# Altium project ESPSpectrumAnalyzer.PrjPcb
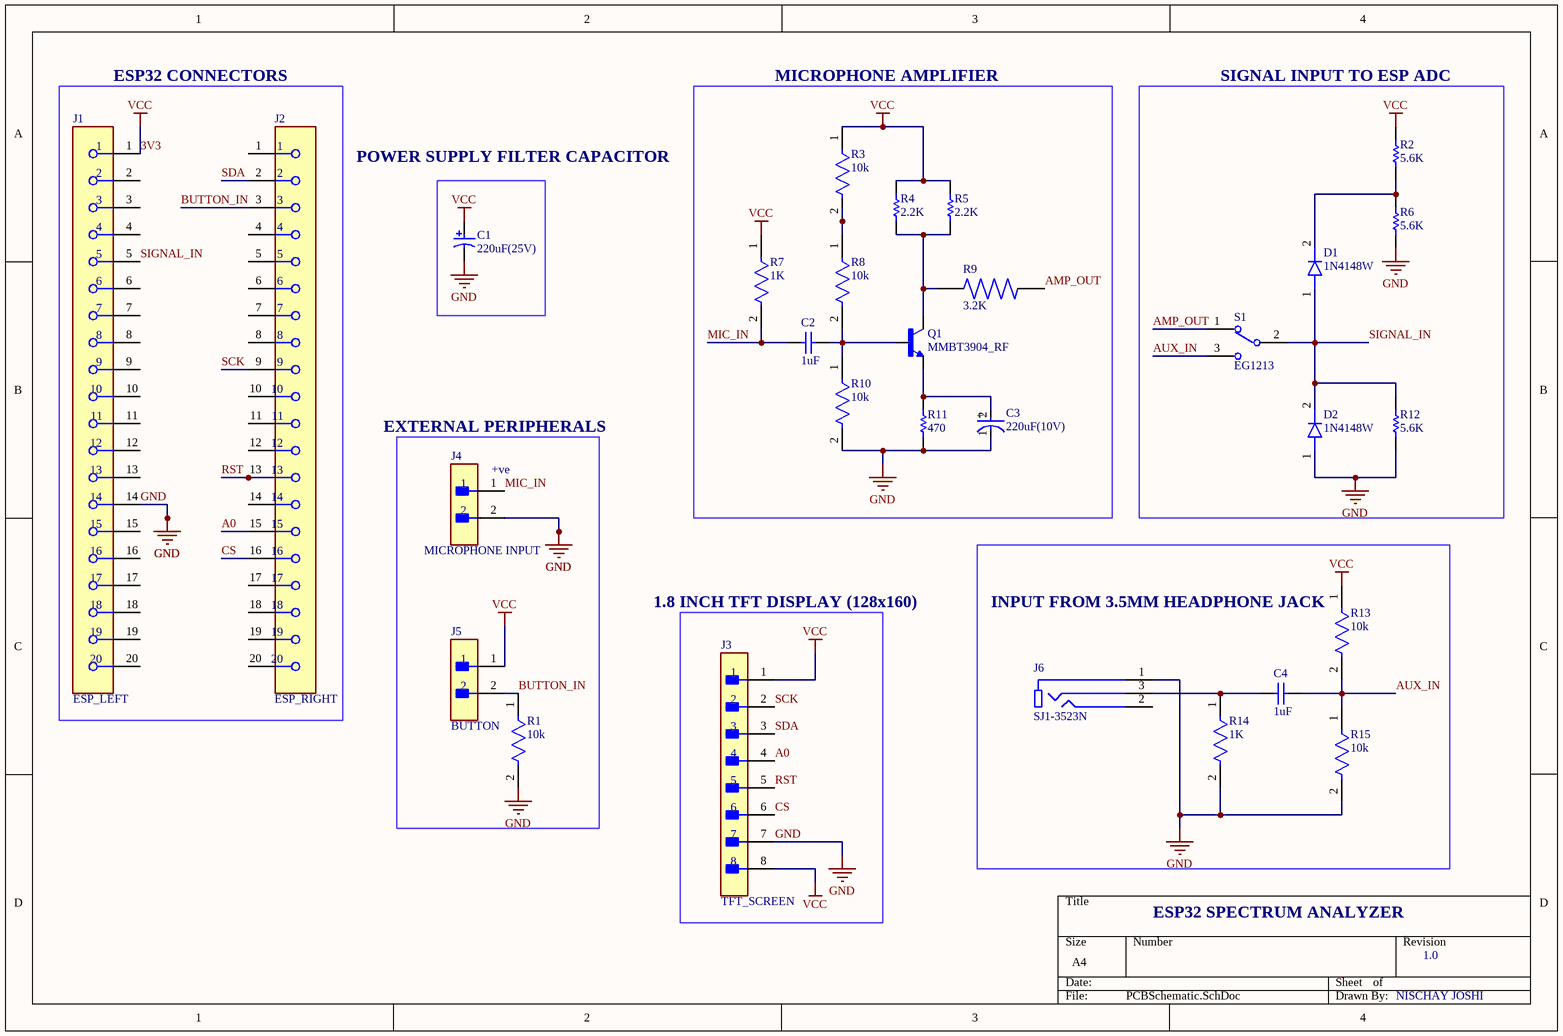
[diagram p0: PCBSchematic.SchDoc]
1 sheet, 29 parts. Net scope: global (net labels, ports and power ports of the same name join across sheets).
Board file: PCB1.PcbDoc

## Sheet PCBSchematic.SchDoc
size A4; SheetNumber: 1; SheetTotal: 2

### Parts
C1  220uF(25V)  [PNSC-EEE-FK1E221P_N]
C2  1uF  [CAPC3216X110X50LL20T25]
C3  220uF(10V)  [FP-TAJD-MFG]
C4  1uF  [CAPC3216X110X50LL20T25]
D1  1N4148W  [SOD523F]
D2  1N4148W  [SOD523F]
J1  ESP_LEFT  [FP-ESQ-120-14-G-S-MFG]
J2  ESP_RIGHT  [FP-ESQ-120-14-G-S-MFG]
J3  TFT_SCREEN  [FP-M20-9990846-MFG]
J4  MICROPHONE INPUT  [FP-M20-9990246-MFG]
J5  BUTTON  [FP-M20-9990246-MFG]
J6  SJ1-3523N  [CUI_SJ1-3523N]
Q1  MMBT3904_RF  [SOT95P237X112-3N]
R1  10k  [FP-RMCF2512-IPC_C]
R2  5.6K  [RESC3216X60X45LL10T20]
R3  10k  [FP-RMCF2512-IPC_C]
R4  2.2K  [RESC3116X65X40ML10T20]
R5  2.2K  [RESC3116X65X40ML10T20]
R6  5.6K  [RESC3216X60X45LL10T20]
R7  1K  [FP-CRCW2512-e3-IPC_C]
R8  10k  [FP-RMCF2512-IPC_C]
R9  3.2K  [RESC3116X65N]
R10  10k  [FP-RMCF2512-IPC_C]
R11  470  [RESC3216X60X45ML10T20]
R12  5.6K  [RESC3216X60X45LL10T20]
R13  10k  [FP-RMCF2512-IPC_C]
R14  1K  [FP-CRCW2512-e3-IPC_C]
R15  10k  [FP-RMCF2512-IPC_C]
S1  EG1213  [SW_EG1213]

### Blocks framed on the sheet
ESP32 CONNECTORS: J1 J2
MICROPHONE AMPLIFIER: C2 C3 Q1 R3-R5 R7-R11
SIGNAL INPUT TO ESP ADC: D1 D2 R2 R6 R12 S1
+ve: J4 J5 R1
INPUT FROM 3.5MM HEADPHONE JACK: C4 J6 R13-R15

### Nets
3V3: C1.1 J1.1 J3.1 J3.8 J5.1 R2.2 R3.1 R4.2 R5.2 R7.1 R13.1  [also labelled VCC]
GND: C1.2 C3.1(C) D2.1(A1) J1.14 J3.7 J4.2 J6.1 R1.2 R6.1 R10.2 R11.1 R12.1 R14.2 R15.2
A0: J2.15 J3.4
AMP_OUT: R9.2 S1.1
AUX_IN: C4.2 R13.2 R15.1 S1.3
BUTTON_IN: J2.3 J5.2 R1.1
CS: J2.16 J3.6
MIC_IN: C2.1 J4.1 R7.2
RST: J2.13 J3.5
SCK: J2.9 J3.2
SDA: J2.2 J3.3
SIGNAL_IN: D1.1(A1) D2.2(C1) J1.5 R12.2 S1.2
NetC2_2: C2.2 Q1.1(B) R8.2 R10.1
NetC3_2: C3.2(A) Q1.2(E) R11.2
NetC4_1: C4.1 J6.3 R14.1
NetD1_2: D1.2(C1) R2.1 R6.2
NetQ1_3: Q1.3(C) R4.1 R5.1 R9.1
NetR3_2: R3.2 R8.1

Not connected (* = marked no-connect by the designer): J1 2 3 4 6 7 8 9 10 11 12 13 15 16 17 18 19 20; J2 1 4 5 6 7 8 10 11 12 14 17 18 19 20; J6 2

### Notes on the sheet
- POWER SUPPLY FILTER CAPACITOR
- EXTERNAL PERIPHERALS
- 1.8 INCH TFT DISPLAY (128x160)
- ESP32 SPECTRUM ANALYZER
- 1.0
- NISCHAY JOSHI
- (in symbol CMP-04424-000647-1) +

### Library data of the parts
C1 = CMP-1665-00017-3: Aluminum Electrolytic Capacitor, 220 uF, +/- 20%, 25 V, -55 to 105 degC, 2-Pin CAPAE, RoHS, Tape and Reel; Manufacturer: Panasonic; ComponentLink2URL: http://industrial.panasonic.com/cdbs/www-data/pdf/RDE0000/ABA0000C1181.pdf; Voltage Rating: 25 V; Height: 10.2 mm; Max Operating Temperature: 105 degC; PackageReference: EEE-FK1E221P; ComponentLink1Description: Manufacturer URL; ComponentLink1URL: http://www.panasonic.com/; Mount: Surface Mount; REACH SVHC: No SVHC; Min Operating Temperature: -55 degC; ComponentLink2Description: Datasheet; DatasheetVersion: 03/2016; Length: 10.2 mm; RoHSCompliant: true; Packaging: Tape and Reel; Package Quantity: 500; Lead Pitch: 3.1 mm; Pins: 2; PackageDescription: 2-Pin Electrolytic Aluminum Capacitor, Body 8.3 x 8.3 mm; Mounting Technology: Surface Mount
C2 C4 = CMP-2000-06011-1: Chip Capacitor, 1 uF, +/- 10%, 50 V, -55 to 125 degC, 1206 (3216 Metric), RoHS, Tape and Reel; Manufacturer: Kemet; Case Height: 1mm; Dielectric: X7R; Voltage Rating: 50V; Temperature Coefficient / Code: +/-15%; Case Length: 3.2mm; Case Width: 1.6mm; Type: SMDMLCCX7R6.3-250VDCCommericalGrade; Class: Class1; Capacitance - nF: 1000nF; Datasheet URL: http://www.kemet.com/docfinder?Partnumber=C1206C105K5RACTU; Product Category: MultilayerCeramicCapacitorsMLCC-SMD/SMT; Capacitance: 1uF; Termination Style: SMD/SMT; Dimensions: 1.6mmWx3.2mmLx1mmH; Voltage Rating DC: 50V; Datasheet Version: 02/2016; Packaging: Reel; Brand: Kemet; RoHS: Details; Minimum Operating Temperature: -55C; Operating Temperature Range: -55Cto+125C; Package Reference: 1206; Manufacturer URL: http://www.kemet.com/; Product: GeneralTypeMLCCs; Tolerance: 10%; Package Description: 2-Pin Surface Mount Device, Body 3.2 x 1.6 mm; Mounting Technology: SurfaceMount; Case Code - mm: 3216; Maximum Operating Temperature: +125C; Series: C1206C; Factory Pack Quantity: 2500; Package / Case: 1206(3216metric); Case Code - in: 1206
C3 = CMP-04424-000647-1: 220uF 10V  ±10% 500mΩ 2917  SMD Tantalum Capacitor; Leakage Current: 22uA; Dissipation Factor: 8%; Polarity: Polar; ESR (Equivalent Series Resistance): 500mR; Height: 2.9mm; Packaging: Tape and Reel; Number of Pins: 2; RoHS Compliant: Yes; Length: 7.3mm; Lead Free: Lead Free; Radiation Hardening: No; Tolerance: 10%; Case Code (Imperial): 2917; Height - Seated (Max): 0.122inch; Min Operating Temperature: -55°C; Series: TAJ; Width: 4.3mm; Case/Package: 2917; Package Quantity: 1; Voltage Rating: 10V; Voltage Rating (DC): 10V; Construction: Flat; Depth: 4.3mm; Capacitance: 220uF; Features: General Purpose; Voltage: 10V; Max Operating Temperature: 125°C; Mount: Surface Mount; Termination: SMD/SMT; REACH SVHC: No SVHC; Dielectric Material: Tantalum; Case Code (Metric): 7343
D1 D2 = 1N4148W: Small signal diode. 150mA, 100V, SOD523F, RS: 761-4283 Fairchild Semiconductor Mfr. Part No. 1N4148WT; MF: {'manufacturer': u'Diotec Semiconductor'}; Package: None; Value: *; Availability: Unavailable; Price: None; MP: 1N4148W
J1 J2 = CMP-02766-000124-1: CONN SOCKET 20POS 0.1 GOLD PCB; Connector Type: Receptacle; Number of Contacts: 20; Contact Resistance: 10mR; Max Voltage Rating (AC): 550V; Max Current Rating: 6.9A; Pitch: 2.54mm; Termination: Solder; Number of Rows: 1; Contact Material: Bronze; Min Operating Temperature: -55°C; Gender: Receptacle; Length: 51.31mm; Orientation: Straight; Max Operating Temperature: 125°C; Radiation Hardening: No; Housing Color: Black; Contact Plating: Gold; REACH SVHC: No SVHC; Packaging: Rail/Tube; Depth: 2.41mm; Housing Material: Polyester; Number of Positions: 20; Mount: Through Hole; Color: Black
J3 = CMP-15831-000033-1: CONN HEADER VERT 8POS 2.54MM; Connector Type: Male Pin; Gender: Male; Insulation Resistance: 1GR; Number of Positions: 8; Contact Resistance: 30mR; Current Rating: 3A; Termination: Solder; Case/Package: SIL; RoHS Compliant: Yes; Series: M20; Housing Material: Nylon; Radiation Hardening: No; Package Quantity: 1000; Contact Material: Brass; Contact Plating: Tin; Max Operating Temperature: 105°C; Contact Mating Length: 0.24inch; Depth: 2.54mm; Color: Black; Number of Contacts: 8; Mount: Through Hole; Number of Rows: 1; Packaging: Bulk; Min Operating Temperature: -40°C; Max Current Rating: 3A; REACH SVHC: No SVHC; Pitch: 2.54mm; Housing Color: Black; Orientation: Straight; Length: 20.32mm; Contact Type: Male Pin
J4 J5 = CMP-15831-000009-1: CONN HEADER VERT 2POS 2.54MM; Manufacturer: Harwin; Manufacturer Part Number: M20-9990246; Conn Gender: Male; Conn Orientation: Vertical; Number Of Contacts: 2; Current Rating: 3A; ComponentLink2URL: https://cdn.harwin.com/pdfs/M20-999.pdf; ComponentLink2Description: Datasheet; Package: M20-9990246; Temperature: -40°C to +105°C; Octopart: https://octopart.com/m20-9990246-harwin-2590635; Mouser Description: 2.54mm (0.1") Pitch SIL Vertical PC Tail Pin Header, 6.1mm mating pin height, tin, 2 contacts; Temperature Range High: +105°C; Device Class L1: Connectors; RoHS: TRUE; Automotive: No; Height: 8.99mm; Number Of Rows: 1; Contact Material: Tin,Nickel; Category: Conn; Pitch: 2.54mm; Lead Free: Yes; Digikey Description: CONN HEADER VERT 2POS 2.54MM; Temperature Range Low: -40°C; Device Class L3: unset; Device Class L2: Headers and Wire Housings
J6 = SJ1-3523N: 3.5 mm Right-Angle Stereo Jack, 3 Pin PCB Mount, Non-Threaded; MF: {'manufacturer': u'CUI Devices'}; Availability: Unavailable; Price: None; MP: SJ1-3523N; Package: None; Value: *
Q1 = MMBT3904_RF: Bipolar (BJT) Transistor NPN 65 V 100 mA 100MHz 200 mW Surface Mount SOT-23; MF: {'manufacturer': u'Taiwan Semiconductor'}; Availability: Unavailable; Price: None; MP: MMBT3904_RF; Package: None; Value: *
R1 R3 R8 R10 R13 R15 = CMP-26527-007115-1: 10kΩ ±5% 1W 2512 Thick Film Chip Resistor AEC-Q200 compliant; Temperature Coefficient: 200ppm/°C; Resistance: 10kR; Max Operating Temperature: 155°C; Lead Free: Lead Free; Width: 0.126inch; Min Operating Temperature: -55°C; Military Standard: Not; Size Code: 2512; RoHS Compliant: Yes; Case Code (Imperial): 2512; Mount: Surface Mount; Radiation Hardening: No; Contact Plating: Tin; Packaging: Tape and Reel; Series: RMCF; Depth: 3.2mm; Resistor Type: Thick Film; Length: 0.248inch; Case Code (Metric): 6432; Power Rating: 1W; Height: 0.028inch; Number of Terminations: 2; Features: Automotive AEC-Q200; Construction: Rectangular; Max Power Dissipation: 1W; Case/Package: 2512; Tolerance: 5%
R2 R6 R12 = CMP-2003-02302-1: Manufacturer: Vishay Dale; Part Number: CRCW12065K60FKEA
R4 R5 = CMP-1014-00546-2: Chip Resistor, 2.2 KOhm, +/- 1%, 250 mW, -55 to 155 degC, 1206 (3216 Metric), RoHS, Tape and Reel; Manufacturer: Yageo; Power Rating: 250mW; Voltage Rating: 200V; Temperature Coefficient: 100ppm/degreesC; RoHSCompliant: true; Packaging: TapeandReel; Termination: SMD/SMT; Case/Package: 1206; Case Code (Imperial): 1206; Manufacturer URL: http://www.yageo.com/; Max Power Dissipation: 250mW; Resistance: 2.2KOhm; Tolerance: 1%; Package Reference: 1206.0; Number of Terminations: 2; Depth: 1.6mm; Case Code (Metric): 3216; Lead Free: LeadFree; REACH SVHC: Unknown; Package Quantity: 1; Datasheet Version: Rev. 5, 10/2016; Length: 3.1mm; Weight: 0.000571oz; Composition: ThickFilm; Width: 0.063inch; Max Operating Temperature: 155degC; Package Description: 2-Pin Surface Mount Device, Body 3.1 x 1.6 mm; Min Operating Temperature: -55degC; Height: 0.55mm; Datasheet URL: http://www.yageo.com/NewPortal/yageodocoutput?fileName=/pdf/R-Chip/PYu-RC_Group_51_RoHS_L_5.pdf; Military Standard: Not
R7 R14 = CMP-02407-005880-1: RES Thick Film, 1kΩ, 1%, 1W, 100ppm/°C, 2512; Resistance: 1kR; Voltage Rating (DC): 500V; Case Code (Metric): 6432; Height: 0.6mm; Termination: SMD/SMT; Weight: 0.001429oz; Packaging: Tape and Reel; Composition: Thick Film; Number of Terminations: 2; Mount: Surface Mount; Max Operating Temperature: 155°C; Tolerance: 1%; Width: 3.15mm; Features: Automotive AEC-Q200; Contact Plating: Tin; Package Quantity: 10; Temperature Coefficient: 100ppm/°C; Lead Free: Lead Free; Power Rating: 1W; Min Operating Temperature: -55°C; Number of Pins: 2; Case/Package: 2512; Military Standard: Not; Max Power Dissipation: 1W; Length: 6.3mm; Depth: 3.15mm; Radiation Hardening: No; Case Code (Imperial): 2512; Voltage Rating: 500V
R9 = TNPW12063K20BEEN: 3.2K OHM .1% 25PPM; MF: {'manufacturer': u'Vishay'}; Availability: Unavailable; Price: None; MP: TNPW12063K20BEEN; Package: None; Value: *
R11 = CMP-2003-02206-1: Manufacturer: Vishay Dale; Part Number: CRCW1206470RFKEA
S1 = EG1213: <b>EG Series SPDT On-On Right Angle Through Hole Slide Switch</b>; MF: {'manufacturer': u'E-Switch'}; Availability: Unavailable; Price: None; MP: EG1213; Package: None; Value: *